# Altium schematic sheet BLErelay.SchDoc
size A3
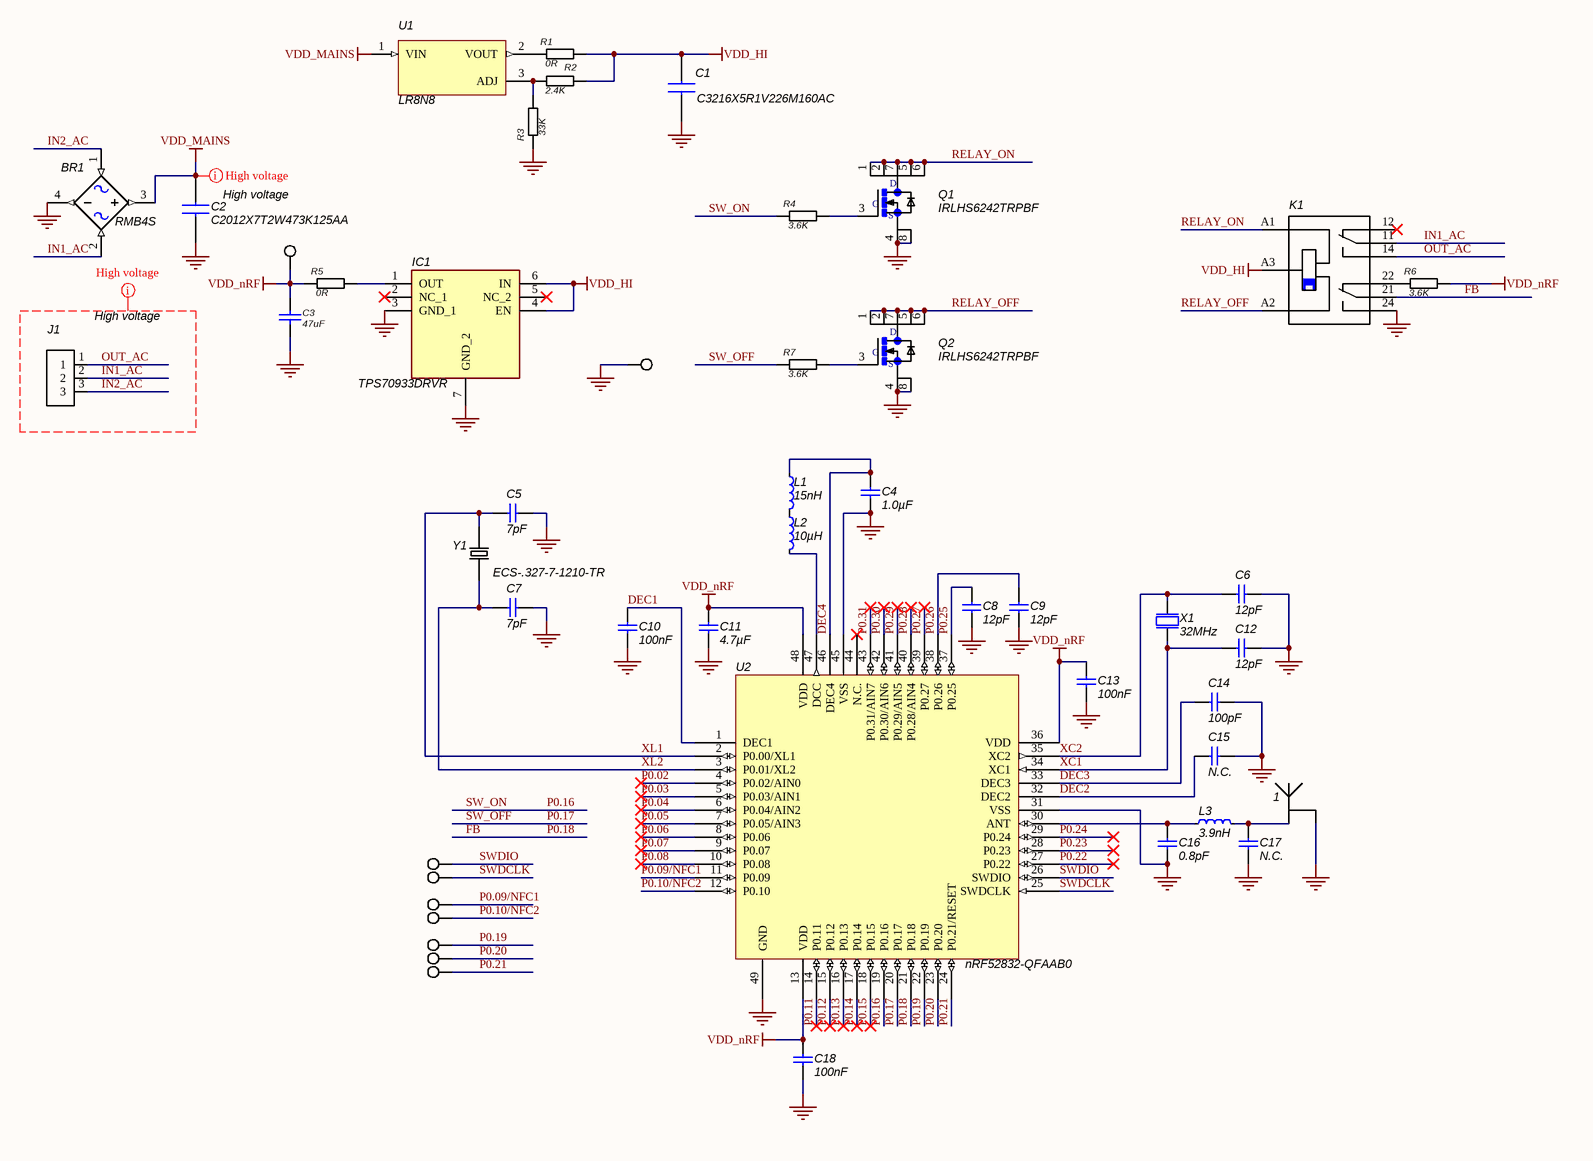
[diagram p0: BLErelay.SchDoc]

## Parts
1  Antenna  [antenna 2.4GHz_MIFA_FR4]  (value not drawn)
BR1  RMB4S  [Vishay_MB2S-E3-45_0]
C1  C3216X5R1V226M160AC  [CAPC3216X180N]
C2  C2012X7T2W473K125AA  [CAPC2012X145N]
C3  47uF  [Res_0805]
C4  1.0µF  [CAPC1608X06L]
C5  7pF  [CAPC1005X04L]
C6  12pF  [CAPC1005X04L]
C7  7pF  [CAPC1005X04L]
C8  12pF  [CAPC1005X04L]
C9  12pF  [CAPC1005X04L]
C10  100nF  [CAPC1005X04L]
C11  4.7µF  [CAPC1608X06L]
C12  12pF  [CAPC1005X04L]
C13  100nF  [CAPC1005X04L]
C14  100pF  [CAPC1005X04L]
C15  N.C.  [CAPC1005X04L]
C16  0.8pF  [CAPC1005X04L]
C17  N.C.  [CAPC1005X04L]
C18  100nF  [CAPC1005X04L]
IC1  TPS70933DRVR  [SON65P200X200X80-7N]
J1  282834-3  [*TE_282834-3]  (value not drawn)
K1  5-1393243-4  [*TE_5-1393243-4_RT424F12(Primary)]  (value not drawn)
L1  15nH  [INDC1005X04L]
L2  10µH  [INDC1608X06L]
L3  3.9nH  [INDC1005X04L]
Q1  IRLHS6242TRPBF  [*QFN65P200X200X100-8N]
Q2  IRLHS6242TRPBF  [*QFN65P200X200X100-8N]
R1  0R  [0402]
R2  2.4K  [0402]
R3  33K  [0402]
R4  3.6K  [0402]
R5  0R  [0402]
R6  3.6K  [0402]
R7  3.6K  [0402]
TP1  Test point  [Testpoint_Keystone_Miniature]  (value not drawn)
TP2  Test point  [Testpoint_Keystone_Miniature]  (value not drawn)
TP3  Test point  [Testpoint_Keystone_Miniature]  (value not drawn)
TP4  Test point  [Testpoint_Keystone_Miniature]  (value not drawn)
TP5  Test point  [Testpoint_Keystone_Miniature]  (value not drawn)
TP6  Test point  [Testpoint_Keystone_Miniature]  (value not drawn)
TP7  Test point  [Testpoint_Keystone_Miniature]  (value not drawn)
TP8  Test point  [Testpoint_Keystone_Miniature]  (value not drawn)
TP9  Test point  [Testpoint_Keystone_Miniature]  (value not drawn)
U1  LR8N8  [SOT89 (TO253AA)]
U2  nRF52832-QFAAB0  [QFN40P600X600X90-48N]
X1  32MHz  [BT-XTAL_2016]
Y1  ECS-.327-7-1210-TR  [*XTAL_ECS-.327-7-1210-TR]

## Nets
GND: 1.2 BR1.4(NEG) C1.1 C2.1 C3.2 C4.1 C5.1 C6.2 C7.1 C8.2 C9.2 C10.2 C11.2 C12.2 C13.2 C14.2 C15.2 C16.1 C17.2 C18.2 IC1.3(GND_1) IC1.7(GND_2) K1.24 Q1.4(S@1) Q1.8(S@2) Q2.4(S@1) Q2.8(S@2) R3.1 TP2.1 U2.31(VSS) U2.45(VSS) U2.49(GND) X1.2(GND) X1.4(GND)
VDD_HI: C1.2 IC1.4(EN) IC1.6(IN) K1.A3 R1.2 R2.2
VDD_MAINS: BR1.3(POS) C2.2 U1.1(VIN)
VDD_nRF: C3.1 C11.1 C13.1 C18.1 R5.1 R6.2 TP1.1 U2.13(VDD) U2.36(VDD) U2.48(VDD)
DEC1: C10.1 U2.1(DEC1)
DEC2: C15.1 U2.32(DEC2)
DEC3: C14.1 U2.33(DEC3)
DEC4: C4.2 L1.1 U2.46(DEC4)
FB: K1.21 U2.21(P0.18)  [also labelled P0.18]
IN1_AC: BR1.2 J1.2 K1.11
IN2_AC: BR1.1 J1.3
OUT_AC: J1.1 K1.14
P0.02: U2.4(P0.02/AIN0)
P0.03: U2.5(P0.03/AIN1)
P0.04: U2.6(P0.04/AIN2)
P0.05: U2.7(P0.05/AIN3)
P0.06: U2.8(P0.06)
P0.07: U2.9(P0.07)
P0.08: U2.10(P0.08)
P0.09/NFC1: TP5.1 U2.11(P0.09)
P0.10/NFC2: TP6.1 U2.12(P0.10)
P0.11: U2.14(P0.11)
P0.12: U2.15(P0.12)
P0.13: U2.16(P0.13)
P0.14: U2.17(P0.14)
P0.15: U2.18(P0.15)
P0.16: R4.1 U2.19(P0.16)  [also labelled SW_ON]
P0.17: R7.1 U2.20(P0.17)  [also labelled SW_OFF]
P0.19: TP7.1 U2.22(P0.19)
P0.20: TP8.1 U2.23(P0.20)
P0.21: TP9.1 U2.24(P0.21/RESET)
P0.22: U2.27(P0.22)
P0.23: U2.28(P0.23)
P0.24: U2.29(P0.24)
P0.25: C8.1 U2.37(P0.25)
P0.26: C9.1 U2.38(P0.26)
P0.27: U2.39(P0.27)
P0.28: U2.40(P0.28/AIN4)
P0.29: U2.41(P0.29/AIN5)
P0.30: U2.42(P0.30/AIN6)
P0.31: U2.43(P0.31/AIN7)
RELAY_OFF: K1.A2 Q2.1(D@1) Q2.2(D@2) Q2.5(D@3) Q2.6(D@4) Q2.7(D@5)
RELAY_ON: K1.A1 Q1.1(D@1) Q1.2(D@2) Q1.5(D@3) Q1.6(D@4) Q1.7(D@5)
SWDCLK: TP4.1 U2.25(SWDCLK)
SWDIO: TP3.1 U2.26(SWDIO)
XC1: C12.1 U2.34(XC1) X1.1(inp)
XC2: C6.1 U2.35(XC2) X1.3(out)
XL1: C5.2 U2.2(P0.00/XL1) Y1.2(OUT/IN)
XL2: C7.2 U2.3(P0.01/XL2) Y1.1(IN/OUT)
Net1_1: 1.1 C17.1 L3.2
NetC16_2: C16.2 L3.1 U2.30(ANT)
NetIC1_1: IC1.1(OUT) R5.2
NetK1_22: K1.22 R6.1
NetL1_2: L1.2 L2.1
NetL2_2: L2.2 U2.47(DCC)
NetQ1_3: Q1.3(G) R4.2
NetQ2_3: Q2.3(G) R7.2
NetR1_1: R1.1 U1.2(VOUT)
NetR2_1: R2.1 R3.2 U1.3(ADJ)

Not connected (* = marked no-connect by the designer): IC1 2(NC_1)* 5(NC_2)*; K1 12*; U2 44(N.C.)*

## Layout directives
net class High voltage: IN1_AC, IN2_AC, OUT_AC, VDD_MAINS

## Notes on the sheet
- (in symbol IRLHS6242TRPBF) D; S

## Library data of the parts
BR1 = RMB4S: MF: SMC Diode; MP: DB107S; Price: None; SnapEDA_Link: https://www.snapeda.com/parts/DB107S/SMC%20Diode%20Solutions/view-part/?ref=snap; Availability: Unavailable; Package: SMD-4 SMC Diode; Value: *
C1 = C3216X5R1V226M160AC: Capacitor; Manufacturer_Name: TDK; Datasheet Link: https://product.tdk.com/info/en/catalog/datasheets/mlcc_commercial_midvoltage_en.pdf; Height: 1.8mm; Manufacturer_Part_Number: C3216X5R1V226M160AC; Mouser Part Number: 810-C3216X5R1V226M; Mouser Price/Stock: https://www.mouser.com/Search/Refine.aspx?Keyword=810-C3216X5R1V226M; RS Part Number: 7883063P; RS Price/Stock: http://uk.rs-online.com/web/p/products/7883063P
C2 = C2012X7T2W473K125AA: Capacitor; Manufacturer_Name: TDK; Datasheet Link: https://product.tdk.com/info/en/catalog/datasheets/mlcc_commercial_midvoltage_en.pdf; Height: 1.45mm; Manufacturer_Part_Number: C2012X7T2W473K125AA; Mouser Part Number: 810-C2012X7T2W473KAA; Mouser Price/Stock: https://www.mouser.com/Search/Refine.aspx?Keyword=810-C2012X7T2W473KAA
C3 = Capacitor 47uF: ComponentLink1Description: Datasheet link; ComponentLink1URL: http://www.yageo.com/documents/recent/UPY-GP_NP0_16V-to-50V_16.pdf
C4 = C0603-1µ0: Capacitor, X7R, ±10%; Part number IPS: 00000000616; Note: 16V; Artikkelnr Noca: 20039335; Artikkelnr Simpro: N.A.; Part Number: C0603-1µ0; Manufacturer: *; Manufacturer Part Number: *; Datasheet: *; LatestRevisionDate: 2013-06-05; Pin Count: 2; Publisher: Nordic Semiconductor; Published: 2009-05-08; Value: 1.0µF; Supplier: *; Supplier part number: *; 2nd source Supplier: *; 2nd source part number: *; Footprint Doc: 0603
C5-C9 C12 = C0402-12p: Capacitor, NP0, ±2%; Part number IPS: 00000002398; Note: 50V; Artikkelnr Noca: 20029159; Artikkelnr Simpro: N.A.; Part Number: C0402-12p; Manufacturer: *; Manufacturer Part Number: *; Datasheet: *; LatestRevisionDate: 2011-05-11; Pin Count: 2; Publisher: Nordic Semiconductor; Published: 2009-05-08; Supplier: *; Supplier part number: *; 2nd source Supplier: *; 2nd source part number: *; Footprint Doc: 0402
  C5 C7: Value: 7pF
  C6 C8 C9 C12: Value: 12pF
C10 C13 C18 = C0402-100n: Capacitor, X7R, ±10%; Part number IPS: 00000005296; Note: 16V; Artikkelnr Noca: 20039200; Artikkelnr Simpro: N.A.; Part Number: C0402-100n; Manufacturer: *; Manufacturer Part Number: *; Datasheet: *; LatestRevisionDate: 2009-11-23; Pin Count: 2; Publisher: Nordic Semiconductor; Published: 2009-05-08; Value: 100nF; Supplier: *; Supplier part number: *; 2nd source Supplier: *; 2nd source part number: *; Footprint Doc: 0402
C11 = C0603-4µ7: Capacitor, X5R, ±10%; Part number IPS: 00000003141; Note: 6.3V; Artikkelnr Noca: 20069060; Artikkelnr Simpro: N.A.; Part Number: C0603-4µ7; Manufacturer: *; Manufacturer Part Number: *; Datasheet: *; LatestRevisionDate: 2009-11-23; Pin Count: 2; Publisher: Nordic Semiconductor; Published: 2009-05-08; Value: 4.7µF; Supplier: *; Supplier part number: *; 2nd source Supplier: *; 2nd source part number: *; Footprint Doc: 0603
C14 = C0402-100p: Capacitor, NP0, ±5%; Part number IPS: 00000002361; Note: 50V; Artikkelnr Noca: 20029135; Artikkelnr Simpro: N.A.; Part Number: C0402-100p; Manufacturer: *; Manufacturer Part Number: *; Datasheet: *; LatestRevisionDate: 2009-05-08; Pin Count: 2; Publisher: Nordic Semiconductor; Published: 2009-05-08; Value: 100pF; Supplier: *; Supplier part number: *; 2nd source Supplier: *; 2nd source part number: *; Footprint Doc: 0402
C15 C17 = C0402-N.C.: Not mounted; Note: Chip Cap; Artikkelnr Noca: N.A.; Assembly: Not mounted; Part Number: C0402-N.C.; Manufacturer: *; Manufacturer Part Number: *; Datasheet: *; Footprint Doc: 0402; LatestRevisionDate: 2009-05-08; Pin Count: 2; Publisher: Nordic Semiconductor; Published: 2009-05-08; Value: N.C.; Supplier: *; Supplier part number: *; 2nd source Supplier: *; 2nd source part number: *; Artikkelnr Simpro: N.A.
C16 = C0402-0.8p: Capacitor, NP0, ±5%; Note: 50V; Artikkelnr Noca: 20029147; Artikkelnr Simpro: N.A.; Part Number: C0402-0.8p; Manufacturer: *; Manufacturer Part Number: *; Datasheet: *; LatestRevisionDate: 2012-11-21; Pin Count: 2; Publisher: Nordic Semiconductor; Published: 2009-05-08; Value: 0.8pF; Supplier: *; Supplier part number: *; 2nd source Supplier: *; 2nd source part number: *; Footprint Doc: 0402
IC1 = TPS70933DRVR: Integrated Circuit; Manufacturer_Name: Texas Instruments; Datasheet Link: http://www.ti.com/lit/gpn/tps709; Height: 0.8mm; Manufacturer_Part_Number: TPS70933DRVR; Mouser Part Number: 595-TPS70933DRVR; Mouser Price/Stock: https://www.mouser.com/Search/Refine.aspx?Keyword=595-TPS70933DRVR
J1 = 282834-3: 3 Position Wire to Board Terminal Block Horizontal with Board 0.100 _2.54mm_; MF: TE Connectivity; TE_purchase_URL: https://www.te.com/usa-en/product-282834-3.html?te_bu=Cor&te_type=disp&te_campaign=seda_glo_cor-seda-global-disp-prtnr-fy19-seda-model-bom-cta_sma-317_1&elqCampaignId=32493; Availability: Unavailable; Package: None; MP: 282834-3; Price: None; SnapEDA_Link: https://www.snapeda.com/parts/282834-3/TE%20Connectivity%20AMP%20Connectors/view-part/?ref=snap; EU_RoHS_Compliance: Compliant with Exemptions; Value: *
K1 = RT424F12: Electromechanical Relay 12VDC 240Ohm 15A DPDT __ 29mm 12.7mm 15.7mm__ THT Power Relay; MF: TE Connectivity; Price: None; SnapEDA_Link: https://www.snapeda.com/parts/RT424F12/TE%20Connectivity%20Potter%20%26%20Brumfield%20Relays/view-part/?ref=snap; Availability: Unavailable; TE_purchase_URL: https://www.te.com/usa-en/product-5-1393243-4.html?te_bu=Cor&te_type=disp&te_campaign=seda_glo_cor-seda-global-disp-prtnr-fy19-seda-model-bom-cta_sma-317_1&elqCampaignId=32493; MP: RT424F12; Package: None; Value: *
L1 = L0402-15n: Inductor, 320mA, ±5%; Manufacturer: Taiyo Yuden; Manufacturer Part Number: HK100515NJ-T; 2nd source part number: 658-1328; Note: High frequency chip inductor ±10%; Artikkelnr Noca: 33029323; Artikkelnr Simpro: N.A.; Part Number: L0402-15n; LatestRevisionDate: 2012-09-19; Pin Count: 2; Publisher: Nordic Semiconductor; Published: 2010-07-12; Value: 15nH; Supplier: Digi-Key; Datasheet: http://www.yuden.co.jp/productdata/catalog/en/mlci04_e.pdf; Supplier part number: 587-1521-1-ND; 2nd source Supplier: Farnell; Footprint Doc: 0402; ComponentLink1Description: Datasheet; ComponentLink2Description: Supplier link
L2 = L0603-10µ: Inductor, 80mA, ±10%; Manufacturer: Taiyo Yuden; Manufacturer Part Number: LBMF1608T100K; 2nd source part number: 178-6105; Note: LBMF1608T100K 10µH 80mA 0603; Artikkelnr Noca: 33029314; Artikkelnr Simpro: N.A.; Part Number: L0603-10µ; Datasheet: http://www.yuden.co.jp/ut/product/pdf/elb2_e.pdf; LatestRevisionDate: 2012-09-19; Pin Count: 2; Publisher: Nordic Semiconductor; Published: 2010-02-24; Value: 10µH; Supplier: Digi-Key; Supplier part number: 587-1714-1-ND; 2nd source Supplier: Farnell; Footprint Doc: 0603; ComponentLink1Description: Datasheet; ComponentLink2Description: Supplier link
L3 = L0402-3n9: Inductor, 170mA, ±0.1nH; Manufacturer: Murata; Manufacturer Part Number: LQP15MN3N9B02D; Note: High frequency chip inductor ±5%; Artikkelnr Noca: 33029151; Artikkelnr Simpro: N.A.; Part Number: L0402-3n9; Datasheet: http://search.murata.co.jp/Ceramy/image/img/PDF/ENG/L0075S0084LQP15M.pdf; LatestRevisionDate: 2012-09-19; Pin Count: 2; Publisher: Nordic Semiconductor; Published: 2009-05-08; Value: 3.9nH; Supplier: Digi-Key; Supplier part number: 490-1131-1-ND; 2nd source Supplier: *; 2nd source part number: *; Footprint Doc: 0402; ComponentLink1Description: Datasheet; ComponentLink2Description: Supplier link
Q1 Q2 = IRLHS6242TRPBF: Single N-Channel 20 V 11.7 mO 14 nC SMT HexFet Power Mosfet - PQFN 2 x 2 mm; MF: Infineon; Price: None; SnapEDA_Link: https://www.snapeda.com/parts/IRLHS6242TRPBF/Infineon%20Technologies/view-part/?ref=snap; Availability: Unavailable; MP: IRLHS6242TRPBF; Package: PQFN-6 Infineon; Value: *
R1 = Resistor 0R
R2 = Resistor 2.4K
R3 = Resistor 33K
R4-R7 = Resistor 3.6K
TP1-TP9 = Test point: Test Point, Miniature, SMT; ComponentLink1Description: Datasheet URL; ComponentLink1URL: http://www.keyelco.com/userAssets/store/files/5015.PDF
U1 = LR8N8: Linear Regulator, Ultra-Wide Input Voltage Range
U2 = nRF52832-QFAAB0: Multi-protocol Bluetooth Low Energy, ANT and 2.4GHz proprietary system-on-chip; Manufacturer: Nordic Semiconductor; Artikkelnr Noca: 15079334; Artikkelnr Simpro: N.A.; Part Number: nRF52832-QFAAB0; Manufacturer Part Number: nRF52832-QFAAB0; Datasheet: *; LatestRevisionDate: 2016-08-25; Pin Count: 48; Publisher: Nordic Semiconductor; Published: 2016-08-25; Value: nRF52832-QFAAB0; Note: *; Supplier: Nordic Semiconductor; Supplier part number: nRF52832-QFAAB0; 2nd source Supplier: *; 2nd source part number: *; Footprint Doc: QFN-48
X1 = XTAL_SMD2016_32MHz_8pF_Epson: XTAL SMD 2016, 32MHz, Cl=8pF, Tol: ±10ppm, Stab: ±10ppm; Manufacturer: Epson Toyocom; Manufacturer Part Number: Q22FA12800025; Note: XTAL SMD 32.000MHz; Artikkelnr Noca: 22019238; Artikkelnr Simpro: N.A.; Part Number: XTAL_SMD2016_32MHz_8pF_Epson; Datasheet: http://www.epsondevice.com/docs/qd/en/DownloadServlet?id=ID000449; LatestRevisionDate: 2014-11-27; Pin Count: 4; Publisher: Nordic Semiconductor; Published: 2012-03-09; Value: 32MHz; Supplier: Farnell; Supplier part number: 171-2806; 2nd source Supplier: *; 2nd source part number: *; Footprint Doc: XTAL_2016
Y1 = ECS-.327-7-1210-TR: CRYSTAL 32.768KHZ 7PFSMD ECX-1210 KHZ Crystal 32.768khz 20ppm 90k OHM -40C ~ 85C 2-SMD; MF: ECS Inc.; Availability: Unavailable; Package: SMD-2 ECS International; Price: None; SnapEDA_Link: https://www.snapeda.com/parts/ECS-.327-7-1210-TR/ECS%20Inc./view-part/?ref=snap; MP: ECS-.327-7-1210-TR; Value: *